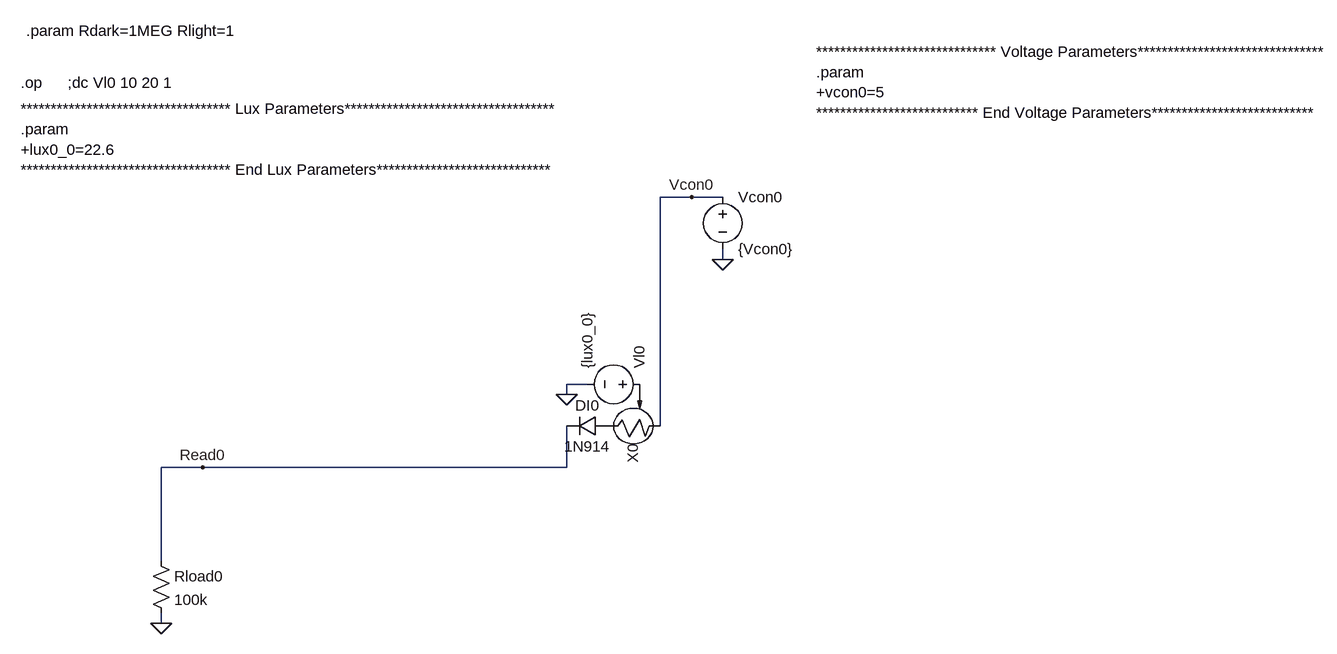
[diagram p0: schematic Photoresistor_Test.asc]
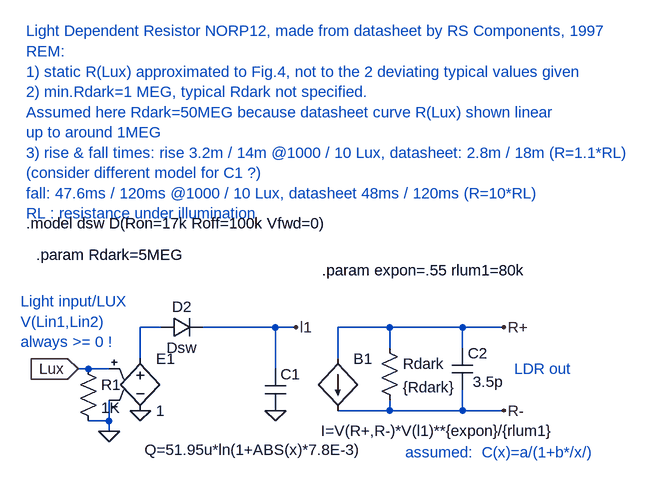
[diagram p1: sub-circuit photoresistor.asc]
Photoresistor_Test.asc, the LTspice schematic file:
Version 4
SHEET 1 2528 868
WIRE 624 -336 576 -336
WIRE 672 -336 624 -336
WIRE 672 -240 672 -256
WIRE 464 -48 432 -48
WIRE 432 -32 432 -48
WIRE 576 16 576 -336
WIRE -128 80 -192 80
WIRE 432 80 432 16
WIRE 432 80 -128 80
WIRE -192 224 -192 80
WIRE -192 320 -192 304
FLAG -192 320 0
FLAG 672 -240 0
FLAG -128 80 Read0
FLAG 624 -336 Vcon0
FLAG 432 -32 0
SYMBOL res -208 208 R0
SYMATTR InstName Rload0
SYMATTR Value 100k
SYMBOL voltage 672 -352 R0
WINDOW 123 0 0 Left 2
WINDOW 39 0 0 Left 2
SYMATTR InstName Vcon0
SYMATTR Value {Vcon0}
SYMBOL diode 496 32 M270
WINDOW 0 32 32 VTop 2
WINDOW 3 0 32 VBottom 2
SYMATTR InstName DI0
SYMATTR Value 1N914
SYMBOL voltage 560 -48 M270
WINDOW 123 0 0 Left 2
WINDOW 39 0 0 Left 2
SYMATTR InstName Vl0
SYMATTR Value {lux0_0}
SYMBOL photoresistor 592 0 R90
SYMATTR InstName X0
TEXT -408 -512 Left 2 !.op
TEXT -408 -472 Left 2 !*********************************** Lux Parameters***********************************\n.param\n+lux0_0=22.6\n*********************************** End Lux Parameters*****************************
TEXT -400 -592 Left 2 !.param Rdark=1MEG Rlight=1
TEXT 816 -560 Left 2 !****************************** Voltage Parameters*******************************\n.param\n+vcon0=5\n*************************** End Voltage Parameters***************************
TEXT -336 -512 Left 2 !;dc Vl0 10 20 1

photoresistor.asc, the sub-circuit schematic file:
Version 4
SHEET 1 880 680
WIRE -112 144 -144 144
WIRE 64 144 -48 144
WIRE 96 144 64 144
WIRE 240 144 160 144
WIRE 352 144 240 144
WIRE 416 144 352 144
WIRE 240 176 240 144
WIRE 352 176 352 144
WIRE -144 192 -144 144
WIRE 160 192 160 144
WIRE -224 208 -240 208
WIRE -192 208 -224 208
WIRE 64 208 64 144
WIRE 240 272 240 256
WIRE 240 272 160 272
WIRE 352 272 352 240
WIRE 352 272 240 272
WIRE 416 272 352 272
WIRE -192 288 -192 256
WIRE -192 288 -224 288
WIRE -192 304 -192 288
FLAG -144 272 0
FLAG 96 144 l1
FLAG -240 208 Lux
IOPIN -240 208 In
FLAG 64 272 0
FLAG 416 144 R+
FLAG 416 272 R-
FLAG -192 304 0
SYMBOL bi 160 192 R0
WINDOW 3 -26 111 Left 2
SYMATTR Value I=V(R+,R-)*V(l1)**{expon}/{rlum1}
SYMATTR InstName B1
SYMBOL e -144 176 R0
SYMATTR InstName E1
SYMATTR Value 1
SYMBOL res 224 160 R0
SYMATTR InstName Rdark
SYMATTR Value {Rdark}
SYMBOL cap 48 208 R0
WINDOW 3 -185 124 Left 2
SYMATTR Value Q=51.95u*ln(1+ABS(x)*7.8E-3)
SYMATTR InstName C1
SYMBOL cap 336 176 R0
WINDOW 3 32 52 Left 2
SYMATTR Value 3.5p
SYMATTR InstName C2
SYMBOL diode -112 160 R270
WINDOW 0 32 32 VTop 2
WINDOW 3 0 32 VBottom 2
SYMATTR InstName D2
SYMATTR Value Dsw
SYMBOL res -240 192 R0
SYMATTR InstName R1
SYMATTR Value 1K
TEXT -328 104 Left 2 ;Light input/LUX\nV(Lin1,Lin2)\nalways >= 0 !
TEXT 432 208 Left 2 ;LDR out
TEXT -320 -312 Left 2 ;Light Dependent Resistor NORP12, made from datasheet by RS Components, 1997\nREM:\n1) static R(Lux) approximated to Fig.4, not to the 2 deviating typical values given\n2) min.Rdark=1 MEG, typical Rdark not specified.\nAssumed here Rdark=50MEG because datasheet curve R(Lux) shown linear\nup to around 1MEG\n3) rise & fall times: rise 3.2m / 14m @1000 / 10 Lux, datasheet: 2.8m / 18m (R=1.1*RL)\n(consider different model for C1 ?)\nfall: 47.6ms / 120ms @1000 / 10 Lux, datasheet 48ms / 120ms (R=10*RL)\nRL : resistance under illumination
TEXT -320 -16 Left 2 !.model dsw D(Ron=17k Roff=100k Vfwd=0)
TEXT 264 336 Left 2 ;assumed:  C(x)=a/(1+b*/x/)
TEXT -304 32 Left 2 !.param Rdark=5MEG
TEXT 136 56 Left 2 !.param expon=.55 rlum1=80k

The netlist it stands for:
* Photoresistor_Test.asc
Rload0 Read0 0 100k
Vcon0 Vcon0 0 {Vcon0}
DI0 P001 Read0 1N914
Vl0 P002 0 {lux0_0}
XX0 P002 Vcon0 P001 photoresistor

* block symbol definitions
.subckt photoresistor Lux R+ R-
B1 R+ R- I=V(R+,R-)*V(l1)**{expon}/{rlum1}
E1 N001 0 Lux 0 1
Rdark R+ R- {Rdark}
C1 l1 0 Q=51.95u*ln(1+ABS(x)*7.8E-3)
C2 R+ R- 3.5p
D2 N001 l1 Dsw
R1 Lux 0 1K
* Light input/LUX
* V(Lin1,Lin2)
* always >= 0 !
* LDR out
* Light Dependent Resistor NORP12, made from datasheet by RS Components, 1997
* REM:
* 1) static R(Lux) approximated to Fig.4, not to the 2 deviating typical values given
* 2) min.Rdark=1 MEG, typical Rdark not specified.
* Assumed here Rdark=50MEG because datasheet curve R(Lux) shown linear
* up to around 1MEG
* 3) rise & fall times: rise 3.2m / 14m @1000 / 10 Lux, datasheet: 2.8m / 18m (R=1.1*RL)
* (consider different model for C1 ?)
* fall: 47.6ms / 120ms @1000 / 10 Lux, datasheet 48ms / 120ms (R=10*RL)
* RL : resistance under illumination
.model dsw D(Ron=17k Roff=100k Vfwd=0)
* assumed:  C(x)=a/(1+b*/x/)
.param Rdark=5MEG
.param expon=.55 rlum1=80k
.ends photoresistor

.model D D
.lib standard.dio
.op
*********************************** Lux Parameters***********************************
.param
+lux0_0=22.6
*********************************** End Lux Parameters*****************************
.param Rdark=1MEG Rlight=1
****************************** Voltage Parameters*******************************
.param
+vcon0=5
*************************** End Voltage Parameters***************************
;dc Vl0 10 20 1
.backanno
.end